# EAGLE schematic Bant Sayici (EAGLE 9.6.2)
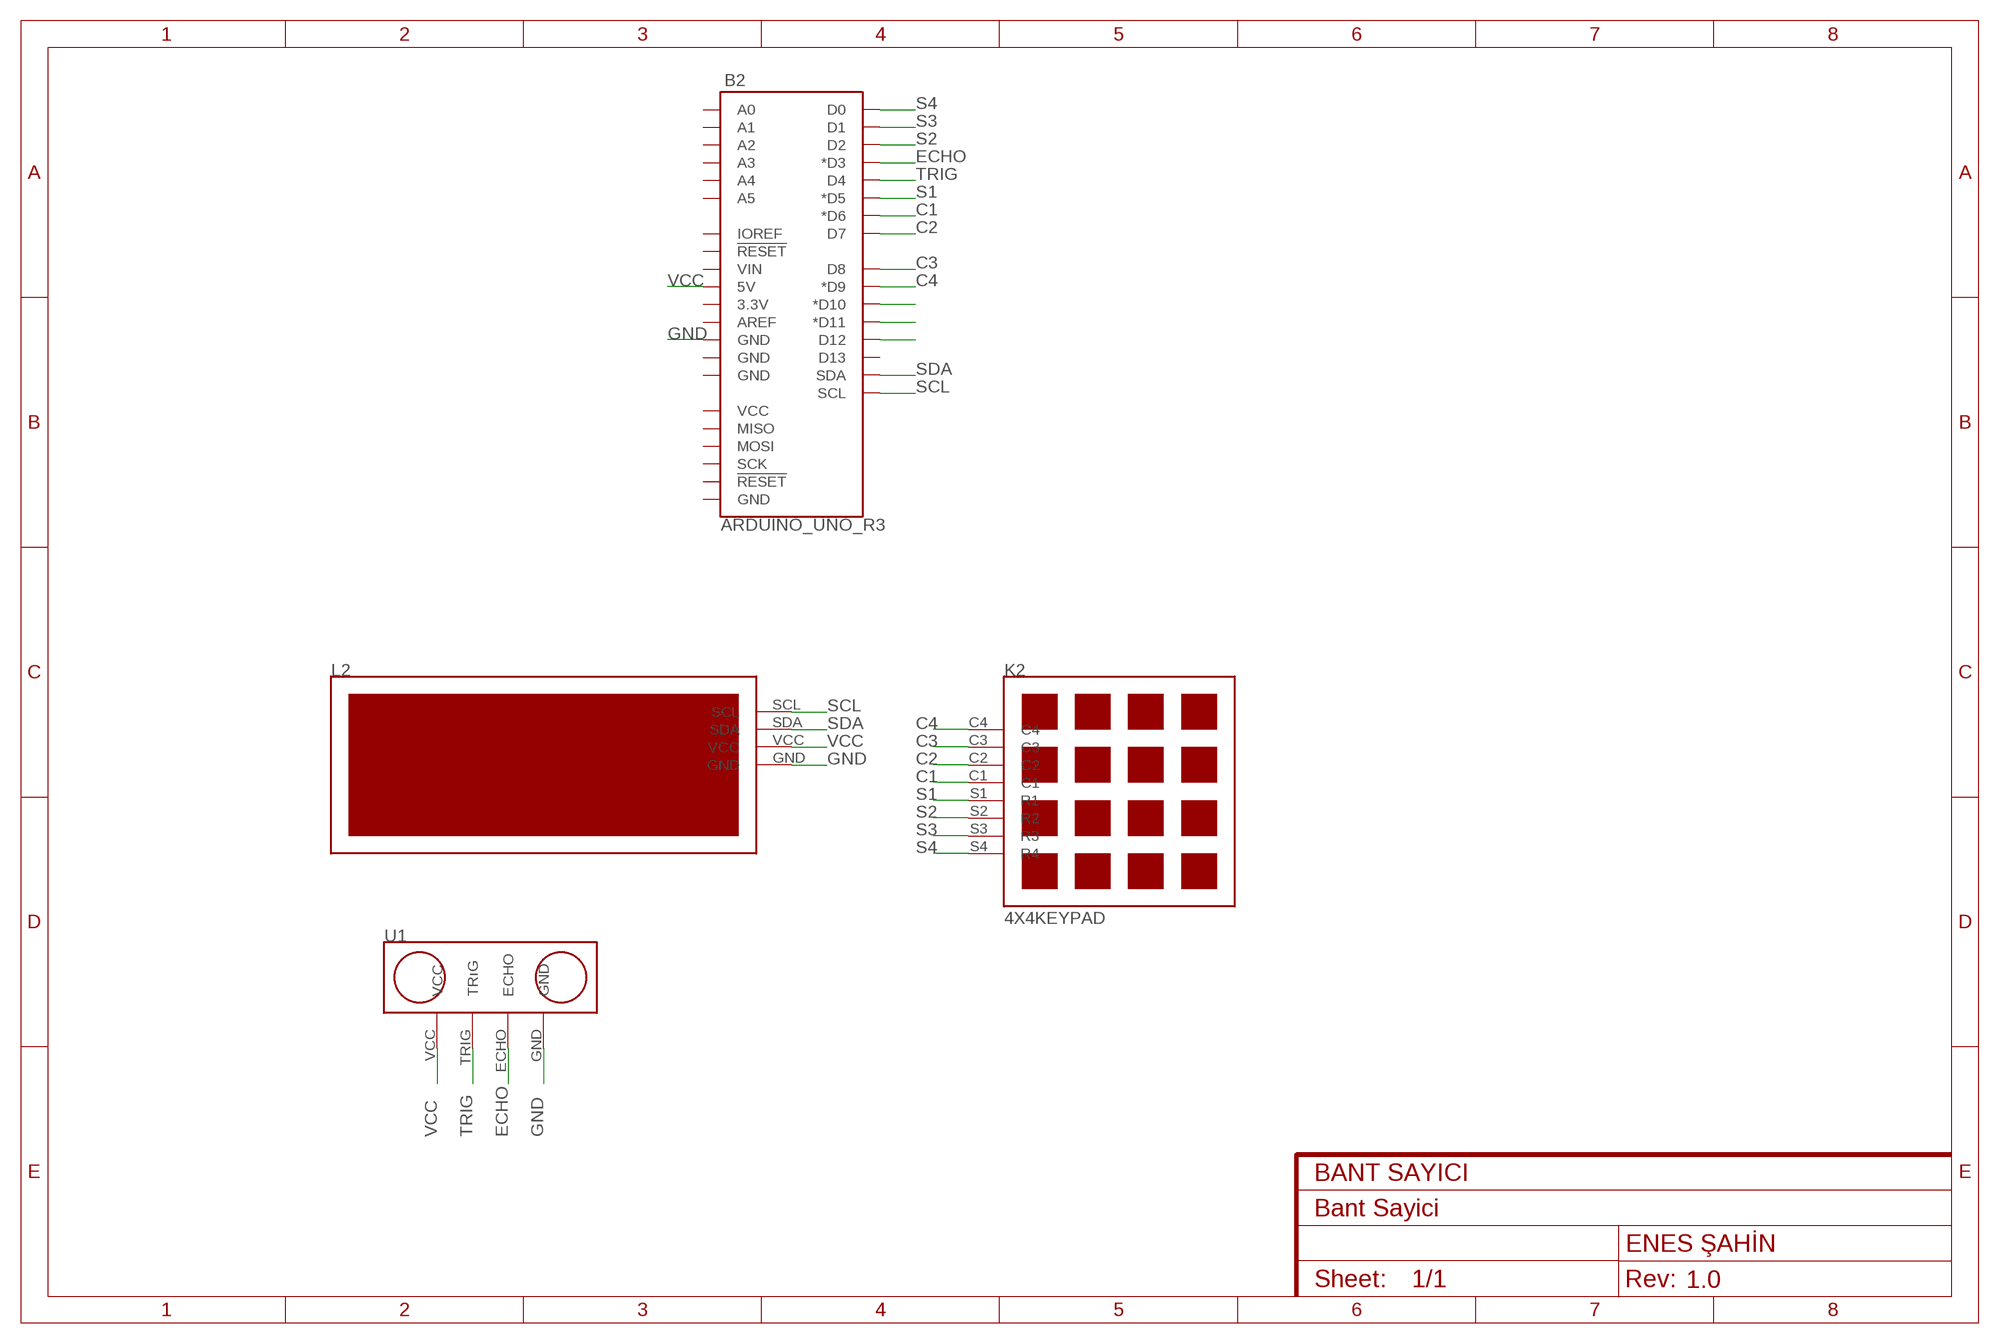
[diagram p0: schematic, sheet 1]
FRAME1 (FRAME-A4L): CNAME: BANT SAYICI; CREVISION: 1.0; DESIGNER: ENES ŞAHİN

## Parts
B2  ARDUINO_UNO_R3  [ARDUINO_R3]
K2  4X4KEYPAD  4X4_KEYPAD  [4X4_KEYPAD]
L2  16X2_LCD  [16X2_LCD]
U1  HCSR-04  [HCSR-04]

## Nets
BUZZER: B2.D12
C1: B2.D6(*D6) K2.C1
C2: B2.D7 K2.C2
C3: B2.D8 K2.C3
C4: B2.D9(*D9) K2.C4
DHT11: B2.D11(*D11)
ECHO: B2.D3(*D3) U1.ECHO
GND: B2.GND@4(GND) L2.GND U1.GND
RST: B2.D10(*D10)
S1: B2.D5(*D5) K2.S1(R1)
S2: B2.D2 K2.S2(R2)
S3: B2.D1 K2.S3(R3)
S4: B2.D0 K2.S4(R4)
SCL: B2.SCL L2.SCL
SDA: B2.SDA L2.SDA
TRIG: B2.D4 U1.TRIG(TRıG)
VCC: B2.5V L2.VCC U1.VCC
Unconnected: B2.3.3V B2.A0 B2.A1 B2.A2 B2.A3 B2.A4 B2.A5 B2.AREF B2.D13 B2.GND@1(GND) B2.GND@2(GND) B2.GND@3(GND) B2.IOREF B2.MISO B2.MOSI B2.RESET@1(!RESET!) B2.RESET@2(!RESET!) B2.SCK B2.VCC B2.VIN

## Library data of the parts
B2 = SparkFun-Boards:ARDUINO_UNO_R3: Arduino R3 Footprint with SPI header Arduino Uno R3 Compatible Footprint. Matches PCB size of the original board. SparkFun Products: SAMD21 Dev Breakout <https://www.sparkfun.com/products/13672> RedBoard <https://www.sparkfun.com/products/12757> R3 Stackable Headers <https://www.sparkfun.com/products/11417>
K2 = MASA YARDIMCISI:4X4_KEYPAD
L2 = MASA YARDIMCISI:16X2_LCD
U1 = Benim Kutuphanem:HCSR-04